# EAGLE design Blow out LED tree - test circuit v1 (EAGLE 9.7.0)
LED CONTROL BLOCK
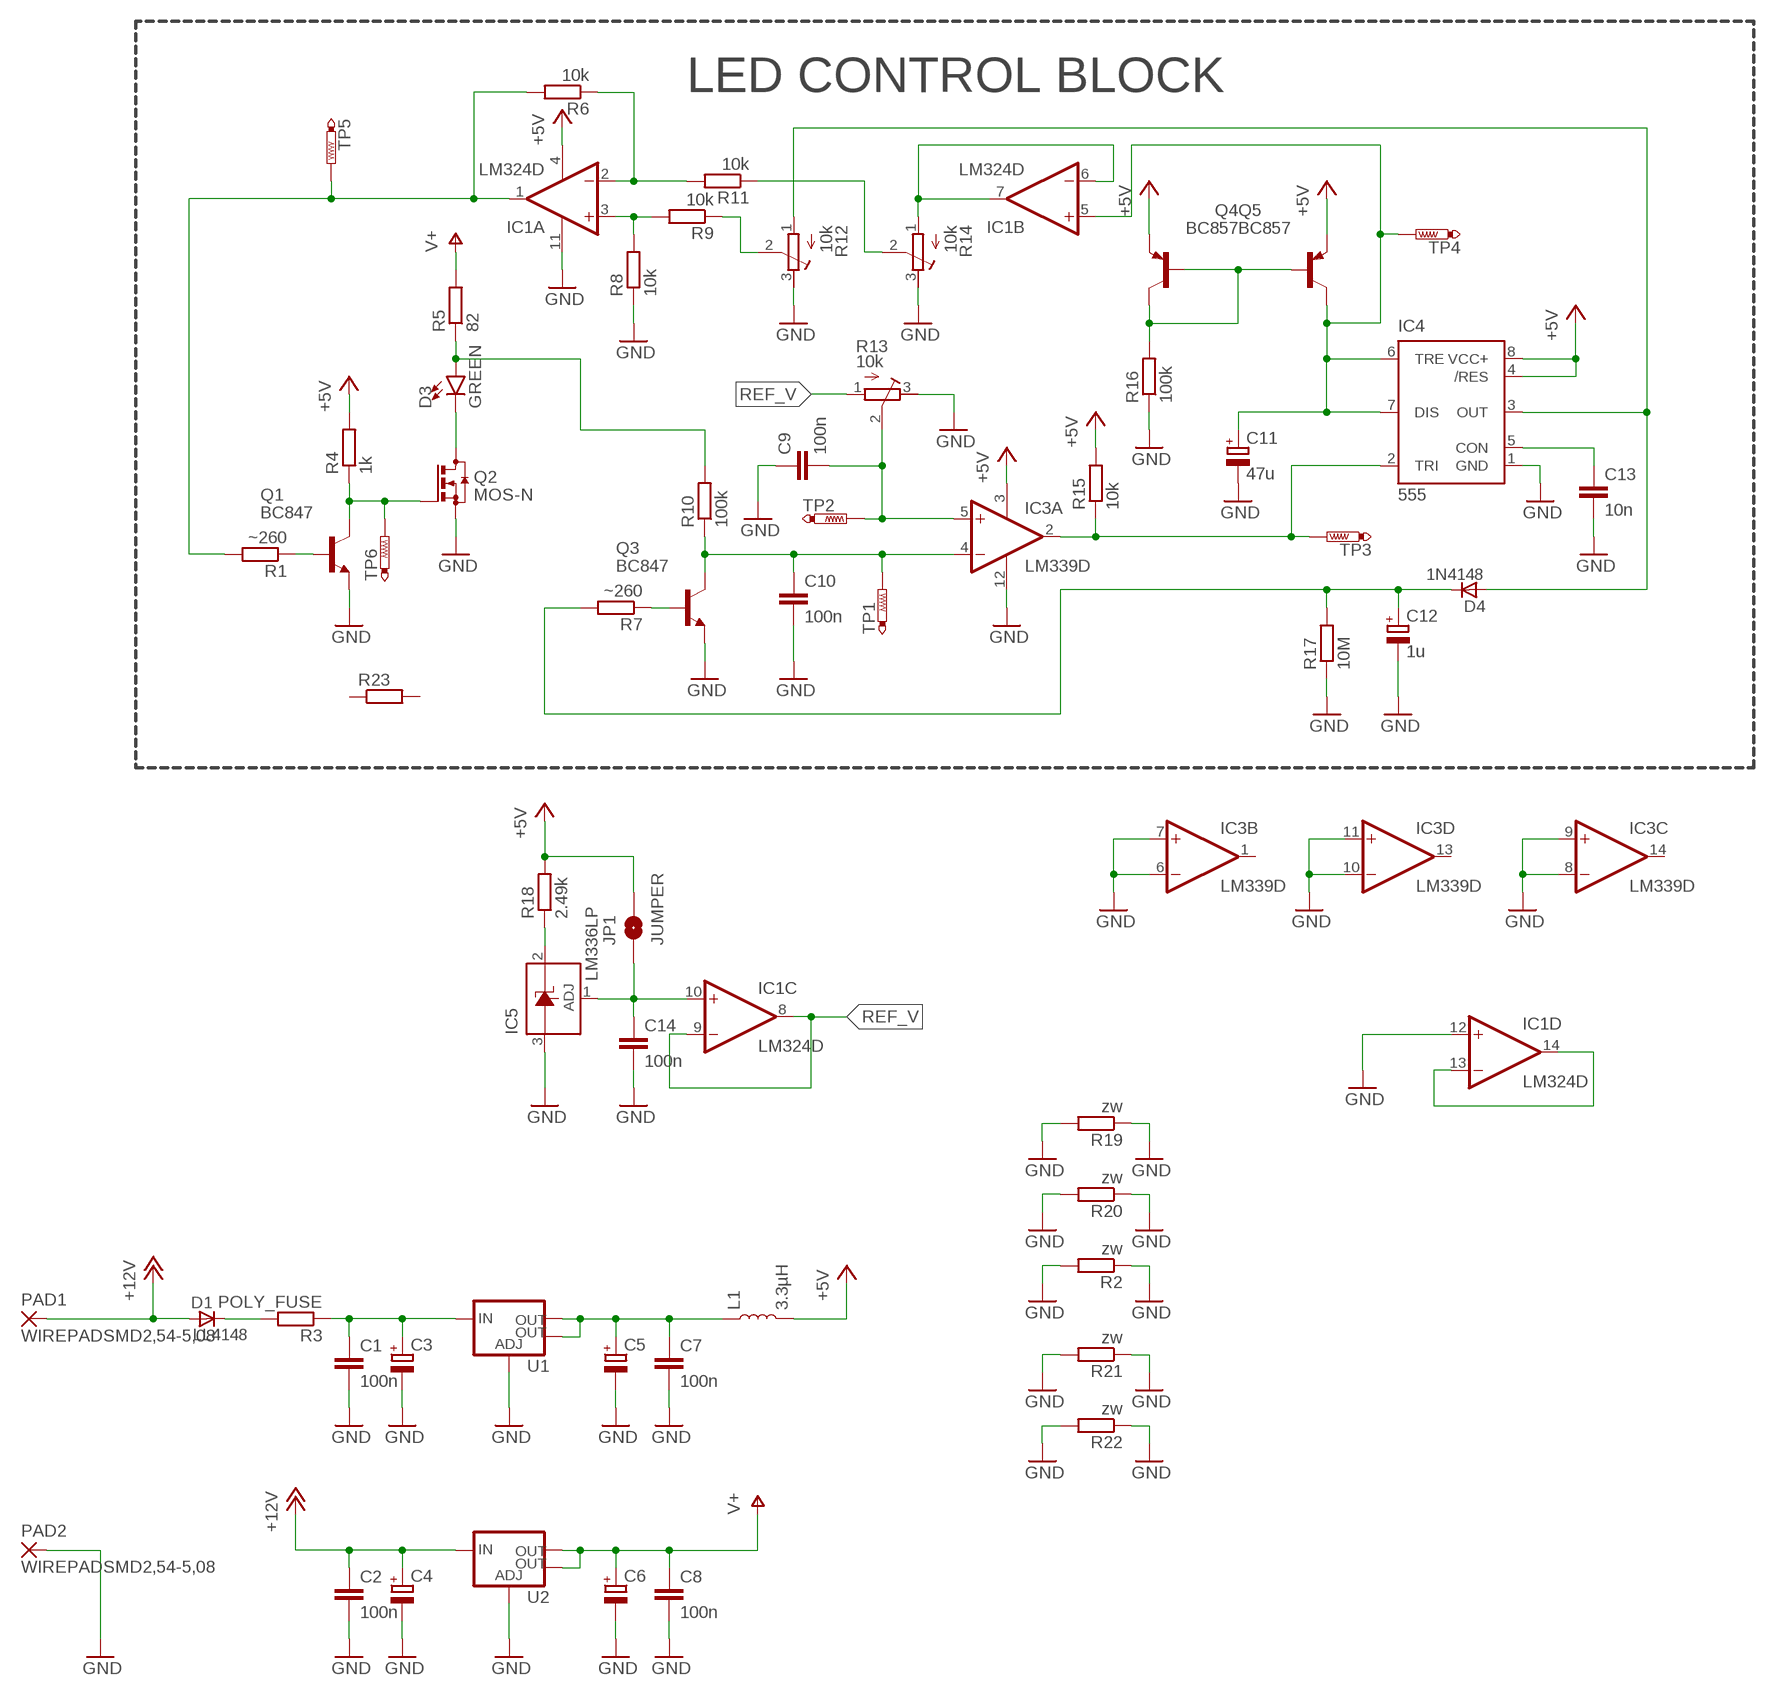
[diagram p0: schematic, sheet 1]

## Parts
C1  100n  C-EUC1206  [C1206]
C2  100n  C-EUC1206  [C1206]
C3  CPOL-EU153CLV-0810  [153CLV-0810]
C4  CPOL-EU153CLV-0810  [153CLV-0810]
C5  CPOL-EU153CLV-0810  [153CLV-0810]
C6  CPOL-EU153CLV-0810  [153CLV-0810]
C7  100n  C-EUC1206  [C1206]
C8  100n  C-EUC1206  [C1206]
C9  100n  C-EUC1206  [C1206]
C10  100n  C-EUC1206  [C1206]
C11  47u  CPOL-EU153CLV-0605  [153CLV-0605]
C12  1u  CPOL-EU153CLV-0605  [153CLV-0605]
C13  10n  C-EUC1206  [C1206]
C14  100n  C-EUC1206  [C1206]
D1  LL4148  [SOD80_DO213AA_MINIMELF]
D3  GREEN  LED-FKIT-1206  [FKIT-LED-1206]
D4  1N4148  LL4148  [SOD80_DO213AA_MINIMELF]
IC1  LM324D  [SO14]
IC3  LM339D  [SO14]
IC4  555  555D  [SO08]
IC5  LM336LP  [TO92]
JP1  JUMPER  JUMPER-SMT_2_NO_NO-SILK_ROUND  [SMT-JUMPER_2_NO_NO-SILK_ROUND]
L1  3.3µH  INDUCTOR-0805-3.3UH  [0805]
PAD1  WIREPADSMD2,54-5,08  [SMD2,54-5,08]
PAD2  WIREPADSMD2,54-5,08  [SMD2,54-5,08]
Q1  BC847  BC847ASMD  [SOT23]
Q2  MOS-N  BSS123  [SOT23]
Q3  BC847  BC847ASMD  [SOT23]
Q4  BC857  BC857ALT1SMD  [SOT23-BEC]
Q5  BC857  BC857ALT1SMD  [SOT23-BEC]
R1  ~260  R-EU_R1206  [R1206]
R2  zw  R-EU_R1206  [R1206]
R3  POLY_FUSE  R-EU_R1206  [R1206]
R4  1k  R-EU_R1206  [R1206]
R5  82  R-EU_R1206  [R1206]
R6  10k  R-EU_R1206  [R1206]
R7  ~260  R-EU_R1206  [R1206]
R8  10k  R-EU_R1206  [R1206]
R9  10k  R-EU_R1206  [R1206]
R10  100k  R-EU_R1206  [R1206]
R11  10k  R-EU_R1206  [R1206]
R12  10k  R-TRIMM3374  [RTRIM3374]
R13  10k  R-TRIMM3374  [RTRIM3374]
R14  10k  R-TRIMM3374  [RTRIM3374]
R15  10k  R-EU_R1206  [R1206]
R16  100k  R-EU_R1206  [R1206]
R17  10M  R-EU_R1206  [R1206]
R18  2.49k  R-EU_R1206  [R1206]
R19  zw  R-EU_R1206  [R1206]
R20  zw  R-EU_R1206  [R1206]
R21  zw  R-EU_R1206  [R1206]
R22  zw  R-EU_R1206  [R1206]
R23  R-EU_R0603  [R0603]
TP1  PTR1B2,54  [B2,54]
TP2  PTR1B2,54  [B2,54]
TP3  PTR1B2,54  [B2,54]
TP4  PTR1B2,54  [B2,54]
TP5  PTR1B2,54  [B2,54]
TP6  PTR1B2,54  [B2,54]
U1  V_REG_LM1117SOT223  [SOT223]
U2  V_REG_LM1117SOT223  [SOT223]

## Nets
+5V: IC1.4(P:V+) IC3.3(P:V+) IC4.4(/RES) IC4.8(VCC+) JP1.2 L1.2 Q4.E Q5.E R4.2 R15.2 R18.2
+12V: C2.1 C4.+ D1.A PAD1.1(P) U2.3(IN)
GND: C1.2 C2.2 C3.- C4.- C5.- C6.- C7.2 C8.2 C9.1 C10.2 C11.- C12.- C13.2 C14.2 IC1.11(P:V-) IC1.12(D:+IN) IC3.6(B:-IN) IC3.7(B:+IN) IC3.8(C:-IN) IC3.9(C:+IN) IC3.10(D:-IN) IC3.11(D:+IN) IC3.12(P:GND) IC4.1(GND) IC5.3(A) PAD2.1(P) Q1.2(E) Q2.2(S) Q3.2(E) R2.1 R2.2 R8.1 R12.3(E) R13.3(E) R14.3(E) R16.1 R17.1 R19.1 R19.2 R20.1 R20.2 R21.1 R21.2 R22.1 R22.2 U1.1(ADJ) U2.1(ADJ)
N$1: D3.A R5.1 R10.2
N$3: C14.1 IC1.10(C:+IN) IC5.1(ADJ) JP1.1
N$4: C10.1 IC3.4(A:-IN) Q3.3(C) R10.1 TP1.TP
N$5: C9.2 IC3.5(A:+IN) R13.2(S) TP2.TP
N$6: Q3.1(B) R7.1
N$7: Q4.B Q4.C Q5.B R16.2
N$8: IC1.6(B:-IN) IC1.7(B:OUT) R14.1(A)
N$9: IC3.2(A:OUT) IC4.2(TRI) R15.1 TP3.TP
N$10: C13.1 IC4.5(CON)
N$11: D4.A IC4.3(OUT) R12.1(A)
N$12: C12.+ D4.C R7.2 R17.2
N$13: IC1.3(A:+IN) R8.2 R9.2
N$14: C11.+ IC1.5(B:+IN) IC4.6(TRE) IC4.7(DIS) Q5.C TP4.TP
N$15: IC1.2(A:-IN) R6.1 R11.2
N$16: IC1.1(A:OUT) R1.2 R6.2 TP5.TP
N$17: R11.1 R14.2(S)
N$18: R9.1 R12.2(S)
N$19: IC5.2(C) R18.1
N$20: Q1.3(C) Q2.1(G) R4.1 TP6.TP
N$21: Q1.1(B) R1.1
N$22: IC1.13(D:-IN) IC1.14(D:OUT)
N$23: D1.C R3.2
N$24: C1.1 C3.+ R3.1 U1.3(IN)
N$25: C5.+ C7.1 L1.1 U1.2(OUT) U1.4(OUT)
N$26: D3.C Q2.3(D)
REF_V: IC1.8(C:OUT) IC1.9(C:-IN) R13.1(A)
V+: C6.+ C8.1 R5.2 U2.2(OUT) U2.4(OUT)
Unconnected: IC3.1(B:OUT) IC3.13(D:OUT) IC3.14(C:OUT) R23.1 R23.2

## Notes on the sheet
- LED CONTROL BLOCK

## Library data of the parts
C1 C2 C7-C10 C13 C14 = rcl:C-EU: CAPACITOR, European symbol; SPICEPREFIX: C
C3-C6 C11 C12 = rcl:CPOL-EU: POLARIZED CAPACITOR, European symbol; SPICEPREFIX: C
D1 D4 = _hhn_diodes_smd:LL4148: 1N4148 General Purpose Rectifie SMD-Version of 1N4148 Case: SOD 80 = DO 213 AA = MINIMELF (Glass) Author: Dipl.-Ing. FH Rainer Bayer HHN Hochschule Heilbronn, rainer.bayer@hs-heilbronn.de Ingenieurbüro ing-rb, mail@ing-rb.de
D3 = SparkFun-LED:LED: LED (Generic) Standard schematic elements and footprints for 5mm, 3mm, 1206, and 0603 sized LEDs. Generic LEDs with no color specified.
IC1 = linear:LM324: OP AMP
IC3 = linear3:LM339: Low Power Low Offset Voltage Quad Comparators with open collector; LM139/LM239/LM339/LM2901/LM3302
IC4 = SparkFun-IC-Special-Function:555: General purpose bipolar Timer Datasheet <http://www.sparkfun.com/datasheets/Components/General/ne555.pdf> SparkFun Products SparkFun SparkPunk Sequencer Kit <https://www.sparkfun.com/products/12707> (KIT-12707) Storefront Component: 555 Timer <https://www.sparkfun.com/products/9273> (COM-09273) Two parts valid for production: VFP: IC-11930 (M7555 PTH) VFP: IC-09173 (555 PTH) - Preferred; PROD_ID: NA-XXXXX
IC5 = linear:LM336: 2.5-V INTEGRATED REFERENCE CIRCUITS LM236 Source: http://focus.ti.com/lit/ds/symlink/lm336-2.5.pdf
JP1 = SparkFun-Jumpers:JUMPER-SMT_2_NO: Normally open jumper This jumper has two pads in close proximity to each other. Apply solder to close the connection. Round pads are easier to solder for beginners, but are a lot larger. SparkFun Product that uses the round pads: SparkFun EL Sequencer <https://www.sparkfun.com/products/12781>
L1 = SparkFun-Coils:INDUCTOR: Inductors Resist changes in electrical current. Basically a coil of wire. SparkFun Products: SparkFun Load Cell Amplifier - HX711 <https://www.sparkfun.com/products/13879> IOIO-OTG - V2.2 <https://www.sparkfun.com/products/13613>; PROD_ID: NDUC-13076; VALUE: 3.3µH/±20%/450mA
PAD1 PAD2 = wirepad:WIREPAD: Wire PAD connect wire on PCB
Q1 Q3 = transistor-npn:BC847*: NPN Transistor
Q2 = transistor-small-signal:BSS123: N-CHANNEL MOS FET
Q4 Q5 = transistor-pnp:BC857*: PNP Transistror
R1-R11 R15-R23 = rcl:R-EU_: RESISTOR, European symbol; SPICEPREFIX: R
R12-R14 = rcl:R-TRIMM: Trimm resistor; SPICEMODEL: X; SPICEPREFIXL: POT
TP1-TP6 = testpad:PTR1: TEST PIN
U1 U2 = SparkFun-IC-Power:V_REG_LM1117: Voltage Regulator LM1117 Standard adjustable voltage regulator but in SMD form. Spark Fun Electronics SKU : COM-00595; PROD_ID: VREG-08170

## Board
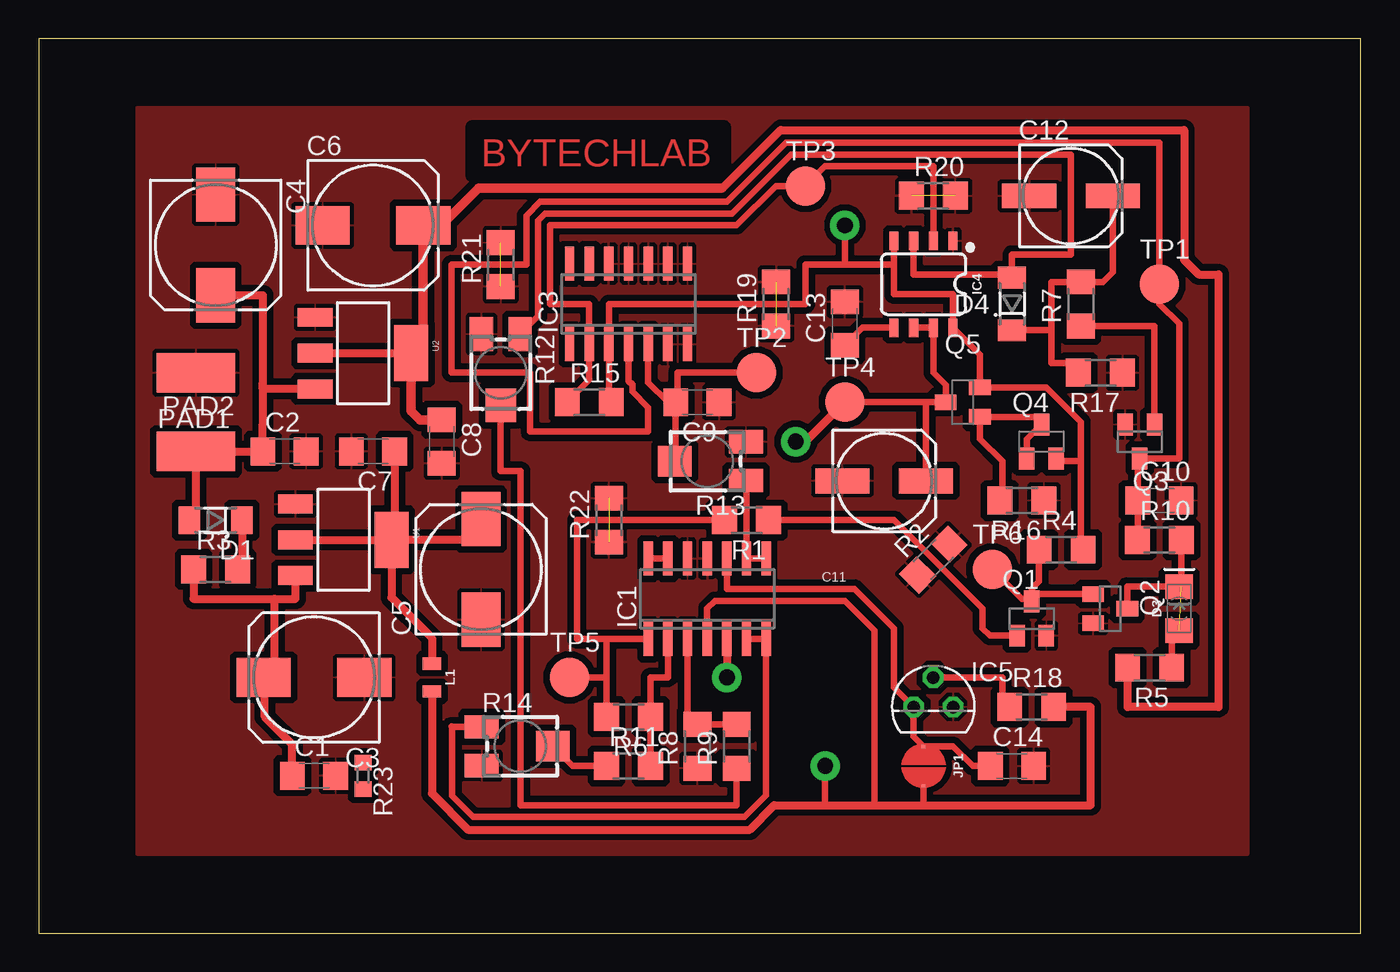
[diagram p1: board, top side]
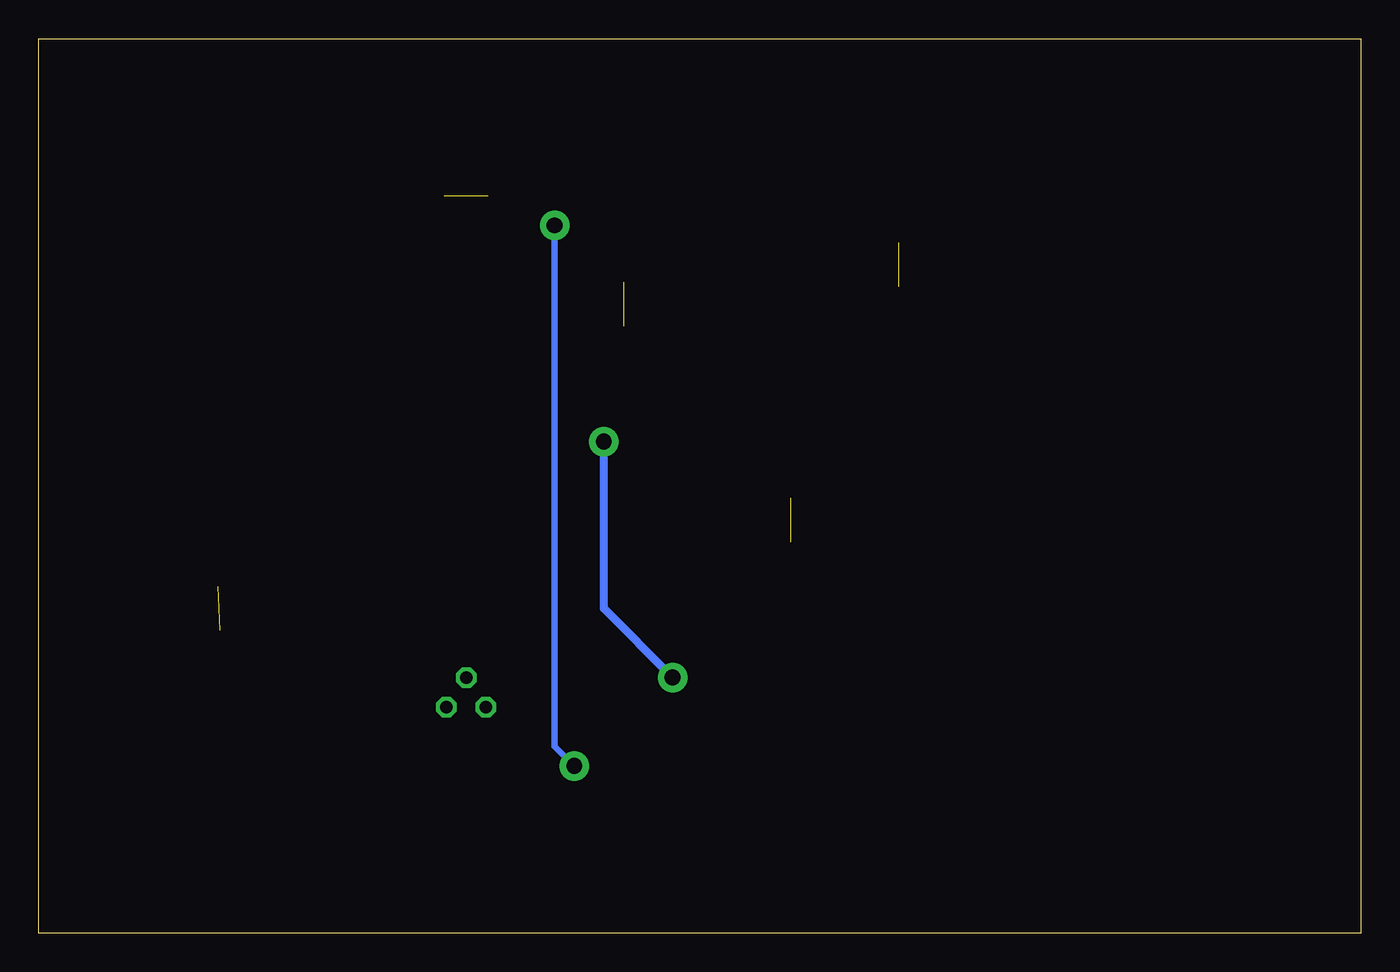
[diagram p2: board, bottom side, seen from below]

Size 85.39 x 57.78 mm. Coordinates in mm from the lower left corner, seen from the top.
Outline: 0,0 85.39,0 85.39,57.78 0,57.78 0,0
Copper layers (1*16): Top / Bottom
Stack-up Default Layer Stack: Top User Defined 0.035mm / Dielectric-1 User Defined 1.5mm / Bottom User Defined 0.035mm
Design rules: minimum copper width 6mil, minimum drill size 0.35mm, copper clearance wire_polygon to wire_polygon 14mil, copper clearance wire_polygon to pad_smd 14mil, copper clearance wire_polygon to via 14mil, copper clearance pad_smd to pad_smd 14mil, copper clearance pad_smd to via 14mil, copper clearance via to via 14mil, copper clearance smd to pad (same net) 14mil, copper clearance smd to via (same net) 14mil, copper clearance smd to smd (same net) 14mil, dimension clearance 40mil, via restrict clearance 0mil, restrict clearance 0mil, drill distance 6mil, keepout clearance 0mil

### Footprints (pad centres in the part's own frame; a part is rotated, then mirrored left to right if it is on the bottom)
C1206 = smd 1.6 x 1.8: 1 -1.4,0; 2 1.4,0
153CLV-0810 = smd 3.5 x 2.5: + 3.25,0; - -3.25,0
153CLV-0605 = smd 3.5 x 1.6: + 2.7,0; - -2.7,0
SOD80_DO213AA_MINIMELF = smd 1.4 x 1.8: A 1.7,0; C -1.7,0
FKIT-LED-1206 = smd 1.6 x 1.803: A -1.422,0; C 1.422,0
SO14 = smd 0.6 x 2.2: 1 -3.81,-2.6; 2 -2.54,-2.6; 3 -1.27,-2.6; 4 0,-2.6; 5 1.27,-2.6; 6 2.54,-2.6; 7 3.81,-2.6; 8 3.81,2.6; 9 2.54,2.6; 10 1.27,2.6; 11 0,2.6; 12 -1.27,2.6; 13 -2.54,2.6; 14 -3.81,2.6
SO08 = smd 0.6 x 1.2: 1 -1.905,-2.8; 2 -0.635,-2.8; 3 0.635,-2.8; 4 1.905,-2.8; 5 1.905,2.8; 6 0.635,2.8; 7 -0.635,2.8; 8 -1.905,2.8
TO92 = drill 0.813 octagon: 1 -1.27,0; 2 0,1.905; 3 1.27,0
SMT-JUMPER_2_NO_NO-SILK_ROUND = smd 0.152 x 0.305: 1 -1.27,0; 2 1.27,0
0805 = smd 0.8 x 1.2: 1 -0.9,0; 2 0.9,0
SMD2,54-5,08 = smd 2.54 x 5.08: 1 0,0
SOT23 = smd 1 x 1.4: 1 -0.95,-1.1; 2 0.95,-1.1; 3 0,1.1
SOT23-BEC = smd 1 x 1.4: B -0.95,-1.1; C 0,1.1; E 0.95,-1.1
R1206 = smd 1.6 x 1.803: 1 -1.422,0; 2 1.422,0
RTRIM3374 = smd 1.5 x 2.2: 1 -1.25,-2.5; 3 1.25,-2.5 | smd 1.98 x 2.17: 2 0,2.1
R0603 = smd 1 x 1.1: 1 -0.85,0; 2 0.85,0
B2,54 = smd 2.54 x 2.54: TP 0,0
SOT223 = smd 1.219 x 2.235: 1 -2.311,-3.099; 2 0,-3.099; 3 2.311,-3.099 | smd 3.6 x 2.2: 4 0,3.099

### Placement (x,y rotation side)
C1  17.78,10.16 0 top
C2  15.87,31.11 0 top
C3  17.78,16.51 180 top
C4  11.43,44.45 270 top
C5  28.57,23.5 90 top
C6  21.59,45.72 0 top
C7  21.59,31.11 180 top
C8  26.04,31.75 270 top
C9  42.55,34.29 180 top
C10  72.39,27.94 0 top
C11  54.61,29.21 0 top
C12  66.67,47.62 0 top
C13  52.07,39.37 90 top
C14  62.87,10.79 0 top
D1  11.43,26.67 180 top
D3  73.66,20.96 90 top
D4  62.87,40.64 90 top
IC1  43.18,21.59 0 top
IC3  38.1,40.64 0 top
IC4  57.15,41.91 180 top
IC5  57.78,14.61 0 top
JP1  57.15,10.79 270 top
L1  25.4,16.51 270 top
PAD1  10.16,31.11 270 top
PAD2  10.16,36.19 90 top
Q1  64.14,20.32 0 top
Q2  69.22,20.96 270 top
Q3  71.12,31.75 180 top
Q4  64.77,31.75 0 top
Q5  59.69,34.29 90 top
R1  45.72,26.67 180 top
R2  57.78,24.13 45 top
R3  11.43,23.5 0 top
R4  66.04,24.76 0 top
R5  71.76,17.14 180 top
R6  38.1,13.97 180 top
R7  67.31,40.64 90 top
R8  42.55,12.06 90 top
R9  45.09,12.06 90 top
R10  72.39,25.4 0 top
R11  38.1,10.79 0 top
R12  29.85,36.19 180 top
R13  43.18,30.48 90 top
R14  31.11,12.06 270 top
R15  35.56,34.29 0 top
R16  63.5,27.94 180 top
R17  68.58,36.19 180 top
R18  64.14,14.61 0 top
R19  47.62,40.64 90 top
R20  57.78,47.62 0 top
R21  29.85,43.18 90 top
R22  36.83,26.67 90 top
R23  20.96,10.16 270 top
TP1  72.39,41.91 0 top
TP2  46.36,36.19 0 top
TP3  49.53,48.26 0 top
TP4  52.07,34.29 0 top
TP5  34.29,16.51 0 top
TP6  61.59,23.5 0 top
U1  19.68,25.4 270 top
U2  20.96,37.47 270 top

### Tracks (layer width: path | path; a pad name or v marks a point on that pad's centre or on a via)
+5V  (via drill 1.02 pad 1.91)
  Top 0.406: IC4.4 55.25,43.18 | 55.25,43.18 55.25,41.28 59.06,41.28 IC4.8 60.79,37.38 Q5.E 65.09,35.24 67.31,33.02 67.31,30.48 | 67.31,30.48 65.89,30.48 Q4.E | R15.2 36.83,34.44 IC3.3 36.83,40.64 49.53,40.64 49.53,43.18 52.07,43.18 | 52.07,43.18 55.25,43.18 | 67.31,30.48 67.31,24.92 R4.2 | IC1.4 43.18,20.96 43.69,21.46 52.07,21.46 53.98,19.56 53.98,8.25 | 57.15,8.25 JP1.2 | 52.07,43.18 v52.07,45.72 | v50.8,10.79 50.8,8.25
  Top 0.508: L1.2 25.4,9.01 27.73,6.68 45.93,6.68 47.5,8.25 50.8,8.25 53.98,8.25 57.15,8.25 67.95,8.25 67.95,14.61 R18.2
  Bottom 0.406: v52.07,45.72 52.07,12.06 v50.8,10.79
+12V
  Top 0.508: C4.+ 14.47,41.2 14.47,35.56 | 14.47,35.56 14.47,32.89 C2.1 PAD1.1 10.16,26.67 D1.A | U2.3 14.47,35.15 14.47,35.56
GND  (4 unrouted)
  pour Top (isolate 0.406): 78.18,53.42 6.27,53.42 6.27,5 78.18,5
N$1  (1 unrouted)
  Top 0.406: R5.1 73.18,19.53 D3.A | R10.2 73.81,22.38
N$3
  Top 0.406: IC1.10 44.45,22.22 52.7,22.22 55.25,19.68 55.25,15.87 IC5.1 56.52,12.7 JP1.1 59.06,12.06 60.33,10.79 C14.1
N$4
  Top 0.406: R10.1 70.99,25.4 C10.1 70.99,30.65 Q3.3 73.66,30.65 73.66,39.37 72.39,40.64 TP1.TP 72.39,51.05 48.26,51.05 44.45,47.24 32.39,47.24 31.5,46.35 31.5,43.18 26.67,43.18 26.67,36.19 31.75,36.19 31.75,32.39 39.37,32.39 39.37,33.94 38.34,34.97 38.34,35.42 38.1,35.66 IC3.4
N$5
  Top 0.406: IC3.5 39.37,35.56 40.64,34.29 C9.2 | R13.2 41.14,30.54 C9.2 | C9.2 41.28,34.42 41.28,36.19 TP2.TP
N$6
  Top 0.406: R7.1 72.07,39.22 Q3.1
N$7
  Top 0.406: Q4.B 63.82,31.9 Q4.C arc90 64.28,33.34 Q5.B 60.79,31.92 62.23,30.48 62.23,28.09 R16.2
N$8
  Top 0.406: IC1.6 IC1.7 46.99,8.89 45.59,7.49 28.07,7.49 26.69,8.87 26.69,13.32 | R14.1 26.69,13.32 | 26.69,13.32 26.67,13.33
N$9
  Top 0.406: IC4.2 57.78,49.53 50.8,49.53 TP3.TP 47.62,48.26 45.09,45.72 33.02,45.72 33.02,40.64 35.56,40.64 IC3.2 35.56,35.71 R15.1
N$10
  Top 0.406: C13.1 53.21,39.11 IC4.5
N$11
  Top 0.406: IC4.3 56.52,42.55 60.96,42.55 62.66,42.55 D4.A 62.87,43.81 66.67,43.81 66.67,50.29 48.58,50.29 44.77,46.48 32.7,46.48 32.26,46.04 32.26,39.86 R12.1
N$12
  Top 0.406: D4.C 65.41,38.94 | 65.41,38.94 65.41,42.06 R7.2 68.73,42.06 69.38,42.7 C12.+ | R17.2 67.16,36.83 65.41,36.83 65.41,38.94
N$13
  Top 0.406: R9.2 R8.2 41.91,13.49 IC1.3
N$14  (via drill 1.02 pad 1.91)
  Top 0.406: IC4.6 IC4.7 57.78,36.19 58.59,35.39 Q5.C 57.15,34.29 | TP4.TP 57.15,34.29 | C11.+ 57.31,34.29 57.15,34.29
  Top 0.508: IC1.5 v44.45,16.51 | v48.89,31.75 49.53,31.75 TP4.TP
  Bottom 0.508: v44.45,16.51 48.89,20.96 v48.89,31.75
N$15
  Top 0.406: IC1.2 40.64,16.51 39.52,16.51 R6.1 R11.2
N$16
  Top 0.406: IC1.1 36.68,18.99 | 36.68,18.99 36.68,17.14 36.68,16.51 | TP5.TP 36.68,16.51 | R1.2 34.77,26.67 34.77,18.99 36.68,18.99 | 36.68,16.51 R6.2
N$17
  Top 0.406: R11.1 34.48,10.79 R14.2
N$18
  Top 0.406: R9.1 45.09,8.25 31.11,8.25 31.11,29.85 29.85,29.85 R12.2
N$19
  Top 0.406: R18.1 62.23,15.09 62.23,16.51 IC5.2
N$20
  Top 0.406: R4.1 64.62,22.71 64.14,22.22 64.14,21.59 | 64.14,21.59 Q1.3 64.62,21.9 Q2.1 | TP6.TP 63.5,21.59 64.14,21.59
N$21
  Top 0.406: R1.1 55.25,26.67 60.96,20.96 60.96,19.68 61.42,19.22 Q1.1
N$22
  Top 0.406: IC1.14 IC1.13
N$23
  Top 0.508: D1.C 13.13,23.5 R3.2
N$24
  Top 0.508: R3.1 10.01,21.59 15.24,21.59 | U1.3 16.59,21.59 15.24,21.59 | C3.+ 14.89,16.86 | 14.89,16.86 15.24,17.22 15.24,21.59 | C1.1 16.38,12.2 14.61,13.97 14.61,16.58 14.89,16.86
N$25
  Top 0.508: C7.1 22.99,25.4 | 22.99,25.4 U1.4 22.78,21.67 25.4,19.05 L1.1 | C5.+ 28.57,25.4 22.99,25.4 | U1.2 22.99,25.4
N$26
  Top 0.406: D3.C 70.31,22.38 Q2.3
REF_V
  Top 0.406: R13.1 45.72,29.19 IC1.9 IC1.8
V+
  Top 0.508: 25.65,45.72 C6.+ | 44.1,48.11 44.17,48.11 47.93,51.87 74,51.87 74,43.48 74.93,42.55 76.2,42.55 76.2,14.61 70.33,14.61 R5.2 | U2.2 U2.4
  Top 0.61: C8.1 24.64,33.15 24.05,33.73 U2.4 24.84,38.25 C6.+ 26.04,45.72 28.42,48.11 44.1,48.11

### Text on the board
Top: BYTECHLAB